# EAGLE schematic interface (EAGLE 6.5.0)
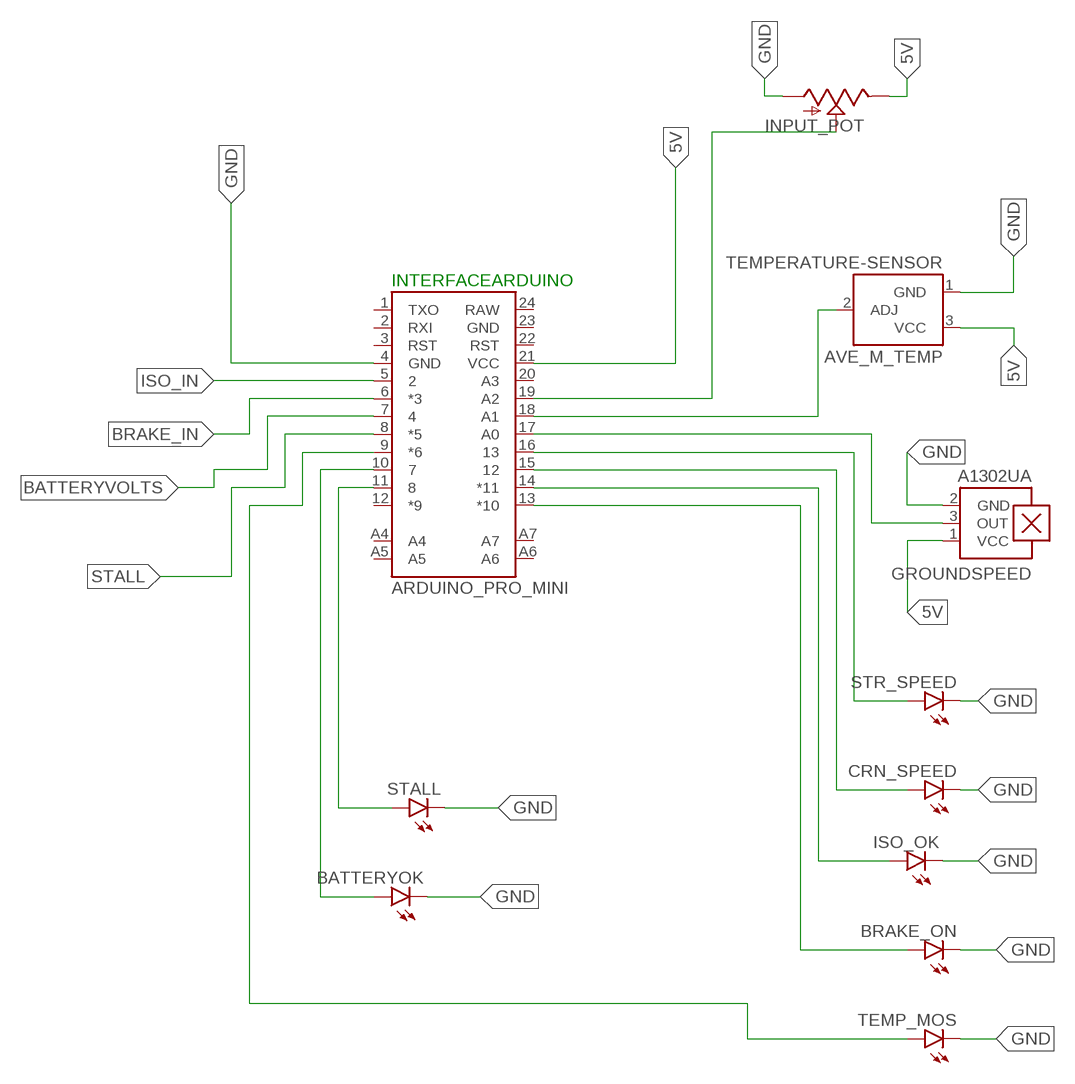
[diagram p0: schematic, sheet 1]

## Parts
AVE_M_TEMP  TEMPERATURE-SENSOR  [TO-92]
BATTERYOK  LED3MM  [LED3MM]
BRAKE_ON  LED3MM  [LED3MM]
CRN_SPEED  LED3MM  [LED3MM]
GROUNDSPEED  A1302UA  [SIP3-UA]
INPUT_POT  SLIDER30MM-KIT  [SLIDER-MEDIUM-KIT]
INTERFACEARDUINO  ARDUINO_PRO_MINI  [ARDUINO_PRO_MINI]
ISO_OK  LED3MM  [LED3MM]
STALL  LED3MM  [LED3MM]
STR_SPEED  LED3MM  [LED3MM]
TEMP_MOS  LED3MM  [LED3MM]

## Nets
5V: AVE_M_TEMP.3(VCC) GROUNDSPEED.1(VCC) INPUT_POT.TOP(E) INTERFACEARDUINO.21(VCC)
BATTERYVOLTS: INTERFACEARDUINO.7
BRAKE_IN: INTERFACEARDUINO.6(*3)
GND: AVE_M_TEMP.1(GND) BATTERYOK.K(C) BRAKE_ON.K(C) CRN_SPEED.K(C) GROUNDSPEED.2(GND) INPUT_POT.BOTTOM(A) INTERFACEARDUINO.4(GND) ISO_OK.K(C) STALL.K(C) STR_SPEED.K(C) TEMP_MOS.K(C)
ISO_IN: INTERFACEARDUINO.5
N$1: INTERFACEARDUINO.16 STR_SPEED.A
N$2: CRN_SPEED.A INTERFACEARDUINO.15
N$3: GROUNDSPEED.3(OUT) INTERFACEARDUINO.17(A0)
N$4: INTERFACEARDUINO.14(*11) ISO_OK.A
N$5: BRAKE_ON.A INTERFACEARDUINO.13(*10)
N$6: AVE_M_TEMP.2(ADJ) INTERFACEARDUINO.18(A1)
N$7: INTERFACEARDUINO.9(*6) TEMP_MOS.A
N$8: BATTERYOK.A INTERFACEARDUINO.10
N$9: INTERFACEARDUINO.11 STALL.A
N$10: INPUT_POT.WIPER(S) INTERFACEARDUINO.19(A2)
STALL: INTERFACEARDUINO.8(*5)
Unconnected: INTERFACEARDUINO.1(TXO) INTERFACEARDUINO.2(RXI) INTERFACEARDUINO.3(RST) INTERFACEARDUINO.12(*9) INTERFACEARDUINO.20(A3) INTERFACEARDUINO.22(RST) INTERFACEARDUINO.23(GND) INTERFACEARDUINO.24(RAW) INTERFACEARDUINO.A4 INTERFACEARDUINO.A5 INTERFACEARDUINO.A6 INTERFACEARDUINO.A7

## Library data of the parts
AVE_M_TEMP = SparkFun-Sensors:TEMPERATURE-SENSOR: TO-92 temp sensor
BATTERYOK BRAKE_ON CRN_SPEED ISO_OK STALL STR_SPEED TEMP_MOS = SparkFun-LED:LED: LEDs Standard schematic elements and footprints for 5mm, 3mm, 1206, and 0603 sized LEDs. 5mm - Spark Fun Electronics SKU : COM-00529 (and others)
GROUNDSPEED = allegro:A13*?: Linear Hall Effect Sensor ICs Continuous-Time Ratiometric High-Temperature Operation Programmable Linear with Analog Output A1302 -Replacement- UGN3503 Source: http://www.allegromicro.com/en/Products/Part_Numbers/1301/1301.pdf http://www.allegromicro.com/en/Products/Part_Numbers/1321/1321.pdf http://www.allegromicro.com/en/Products/Part_Numbers/1381/1381.pdf; MF: ALLEGRO MICROSYSTEMS, INC.; MPN: A1302EUA-T; OC_FARNELL: 1521708; OC_NEWARK: 31K6639
INPUT_POT = SparkFun-Electromechanical:SLIDER: Slide-type potentiometers. Small and meduim footprints untested.; PROD_ID: RES-11931
INTERFACEARDUINO = SparkFun-Boards:ARDUINO_PRO_MINI